# EAGLE design MotorController (EAGLE 9.1.3)
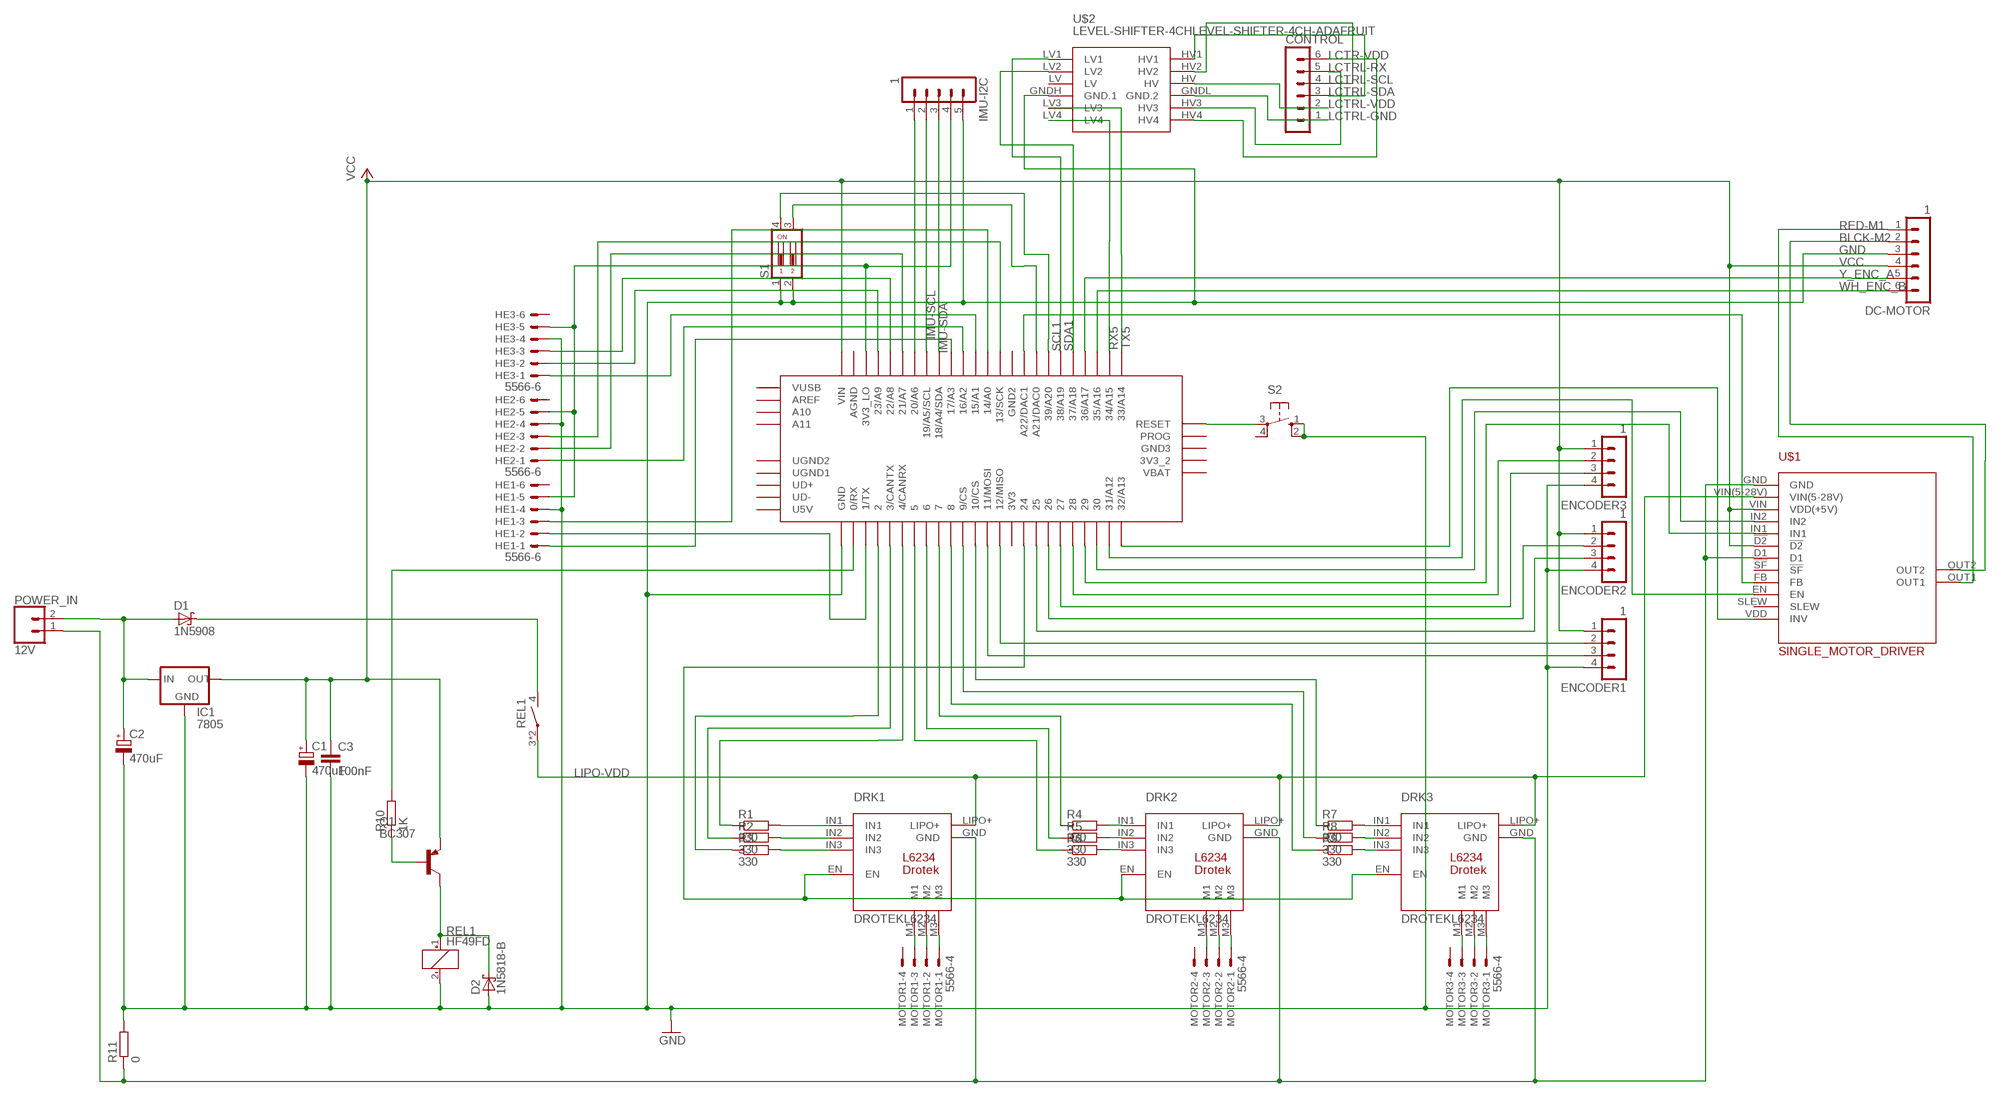
[diagram p0: schematic, sheet 1]

## Parts
C1  470uF  CPOL-EUE7.5-16  [E7,5-16]
C2  470uF  CPOL-EUE7.5-16  [E7,5-16]
C3  100nF  C2.5/2  [C2.5-2]
CONTROL  MA06-1  [MA06-1]
D1  1N5908  [C4111-15]
D2  1N5818-B  [DO41-7.6]
DC-MOTOR  1  MA06-1  [MA06-1]
DRK1  DROTEKL6234  [DROTEKL6234]
DRK2  DROTEKL6234  [DROTEKL6234]
DRK3  DROTEKL6234  [DROTEKL6234]
ENCODER1  1  MA04-1  [MA04-1]
ENCODER2  1  MA04-1  [MA04-1]
ENCODER3  1  MA04-1  [MA04-1]
HE1  5566-6  [5566-6]
HE2  5566-6  [5566-6]
HE3  5566-6  [5566-6]
IC1  7805  78XXL  [78XXL]
IMU-I2C  1  MA05-1  [MA05-1]
MOTOR1  5566-4  [5566-4]
MOTOR2  5566-4  [5566-4]
MOTOR3  5566-4  [5566-4]
POWER_IN  12V  CONN_023.5MM  [SCREWTERMINAL-3.5MM-2]
PRJ1  TEENSY_3.5/3.6  [TEENSY_3.5/3.6]
Q1  BC307  [TO92]
R1  330  R-EU_0204/7  [0204/7]
R2  330  R-EU_0204/7  [0204/7]
R3  330  R-EU_0204/7  [0204/7]
R4  330  R-EU_0204/7  [0204/7]
R5  330  R-EU_0204/7  [0204/7]
R6  330  R-EU_0204/7  [0204/7]
R7  330  R-EU_0204/7  [0204/7]
R8  330  R-EU_0204/7  [0204/7]
R9  330  R-EU_0204/7  [0204/7]
R10  1K  R-EU_0204/7  [0204/7]
R11  0  R-EU_0204/2V  [0204V]
REL1  HF49FD  [HF49FD]
S1  DA02  [DA-02]
S2  10-XX  [B3F-10XX]
U$1  SINGLE_MOTOR_DRIVER  [MOTOR_DRIVER_MC33926_FOOTPRINT_]
U$2  LEVEL-SHIFTER-4CHLEVEL-SHIFTER-4CH-ADAFRUIT  [LEVEL-SHIFTER-4CH-ADAFRUIT]

## Nets
BLCK-M2 [Powerline]: DC-MOTOR.2 U$1.OUT2
GND: C1.- C2.- C3.2 D2.A DC-MOTOR.3 ENCODER1.4 ENCODER2.4 ENCODER3.4 HE1.4 HE2.4 HE3.4 IC1.GND IMU-I2C.5 PRJ1.GND R11.2 REL1.2(-) S1.1 S1.2 S2.1(S) S2.2(S1) U$2.GNDH(GND.1)
IMU-SCL: IMU-I2C.2 PRJ1.19/A5/SCL
IMU-SDA: IMU-I2C.3 PRJ1.18/A4/SDA
LCTR-VDD: CONTROL.6 U$2.HV4
LCTRL-GND: CONTROL.1 U$2.GNDL(GND.2)
LCTRL-RX: CONTROL.5 U$2.HV3
LCTRL-SCL: CONTROL.4 U$2.HV2
LCTRL-SDA: CONTROL.3 U$2.HV1
LCTRL-VDD: CONTROL.2 U$2.HV
LIPO-GND [Powerline]: DRK1.GND DRK2.GND DRK3.GND POWER_IN.1 R11.1 U$1.D1 U$1.GND
LIPO-VDD [Powerline]: DRK1.LIPO+ DRK2.LIPO+ DRK3.LIPO+ REL1.3(P) REL1.5(P) U$1.VIN(5-28V)
N$1 [Powerline]: DRK1.M1 MOTOR1.3
N$2 [Powerline]: DRK1.M2 MOTOR1.2
N$3 [Powerline]: DRK1.M3 MOTOR1.1
N$4: DRK1.IN1 R1.2
N$5: DRK1.IN2 R2.2
N$6: DRK1.IN3 R3.2
N$7: PRJ1.4/CANRX R1.1
N$8: PRJ1.3/CANTX R2.1
N$9: PRJ1.2 R3.1
N$10: DRK1.EN DRK2.EN DRK3.EN PRJ1.24
N$11: DRK2.IN1 R4.2
N$12: PRJ1.21/DAC0(A21/DAC0) S1.3
N$13 [Powerline]: DRK2.M1 MOTOR2.3
N$14 [Powerline]: DRK2.M2 MOTOR2.2
N$15 [Powerline]: DRK2.M3 MOTOR2.1
N$16 [Powerline]: DRK3.M1 MOTOR3.3
N$17 [Powerline]: DRK3.M2 MOTOR3.2
N$18 [Powerline]: DRK3.M3 MOTOR3.1
N$19: DRK2.IN2 R5.2
N$20: DRK2.IN3 R6.2
N$21: PRJ1.5 R6.1
N$22: PRJ1.6 R5.1
N$23: PRJ1.7 R4.1
N$24: DRK3.IN2 R8.2
N$25: DRK3.IN1 R7.2
N$26: DRK3.IN3 R9.2
N$27: PRJ1.8 R9.1
N$28: PRJ1.9/CS R8.1
N$29: PRJ1.10/CS R7.1
N$30: Q1.2(B) R10.1
N$31: D2.C Q1.3(C) REL1.1(+)
N$32 [Powerline]: C2.+ D1.A IC1.IN POWER_IN.2
N$33: ENCODER1.3 PRJ1.11/MOSI
N$34: ENCODER1.2 PRJ1.12/MISO
N$35: ENCODER2.3 PRJ1.25
N$36: ENCODER2.2 PRJ1.26
N$37: ENCODER3.3 PRJ1.27
N$38: ENCODER3.2 PRJ1.28
N$39 [Powerline]: D1.C REL1.4(S)
N$40: PRJ1.39/A20 S1.4
N$41: PRJ1.32/A13 U$1.VDD(INV)
N$42: PRJ1.0/RX R10.2
N$44: PRJ1.29 U$1.IN1
N$45: PRJ1.31/A12 U$1.EN
N$46: HE1.5 HE2.5 HE3.5 IMU-I2C.4 PRJ1.3V3_LO
N$47: PRJ1.30 U$1.IN2
N$48: IMU-I2C.1 PRJ1.20/A6
N$49: HE3.2 PRJ1.23/A9
N$50: HE3.3 PRJ1.22/A8
N$51: HE2.2 PRJ1.21/A7
N$52: PRJ1.RESET S2.3(P)
N$54: HE1.1 PRJ1.17/A3
N$55: HE2.1 PRJ1.16/A2
N$56: HE3.1 PRJ1.15/A1
N$57: HE1.2 PRJ1.1/TX
N$58: HE1.3 PRJ1.14/A0
N$59: HE2.3 PRJ1.13/SCK
N$60: PRJ1.A22/DAC1 U$1.FB
RED-M1 [Powerline]: DC-MOTOR.1 U$1.OUT1
RX5: PRJ1.34/A15 U$2.LV4
SCL1: PRJ1.38/A19 U$2.LV1
SDA1: PRJ1.37/A18 U$2.LV2
TX5: PRJ1.33/A14 U$2.LV3
VCC: C1.+ C3.1 DC-MOTOR.4 ENCODER1.1 ENCODER2.1 ENCODER3.1 IC1.OUT PRJ1.VIN Q1.1(E) U$1.!D2 U$1.VIN(VDD(+5V))
WH_ENC_B: DC-MOTOR.6 PRJ1.35/A16
Y_ENC_A: DC-MOTOR.5 PRJ1.36/A17
Unconnected: HE1.6 HE2.6 HE3.6 MOTOR1.4 MOTOR2.4 MOTOR3.4 PRJ1.3V3 PRJ1.3V3_2 PRJ1.A10 PRJ1.A11 PRJ1.AGND PRJ1.AREF PRJ1.GND2 PRJ1.GND3 PRJ1.PROG PRJ1.U5V PRJ1.UD+ PRJ1.UD- PRJ1.UGND1 PRJ1.UGND2 PRJ1.VBAT PRJ1.VUSB S2.4(P1) U$1.!SF U$1.SLEW

## Power pins joined to a net without a drawn wire
LV: U$2.LV

## Library data of the parts
C1 C2 = rcl:CPOL-EU: POLARIZED CAPACITOR, European symbol; SPICEPREFIX: C
C3 = capacitor-wima:C: CAPACITOR naming: grid - package width
CONTROL DC-MOTOR = con-lstb:MA06-1: PIN HEADER; OC_FARNELL: unknown; OC_NEWARK: unknown
D1 = diode:1N5908: DIODE schottky
D2 = diode:1N581*: 1.0A SCHOTTKY BARRIER RECTIFIER Source: http://www.diodes.com/datasheets/ds23001.pdf
DRK1-DRK3 = Drotek L6234:DROTEKL6234
ENCODER1-ENCODER3 = con-lstb:MA04-1: PIN HEADER; OC_FARNELL: unknown; OC_NEWARK: unknown
HE1-HE3 = con-molex:5566-6: Mini FIT connector 6 pol Source: http://www.molex.com; MF: MOLEX; MPN: 95566-61002; OC_FARNELL: unknown; OC_NEWARK: 22K8620
IC1 = v-reg:78XXL: VOLTAGE REGULATOR
IMU-I2C = con-lstb:MA05-1: PIN HEADER; OC_FARNELL: unknown; OC_NEWARK: unknown
MOTOR1-MOTOR3 = con-molex:5566-4: Mini FIT connector 4 pol Source: http://www.molex.com; MF: MOLEX; OC_FARNELL: unknown; OC_NEWARK: unknown
POWER_IN = SparkFun-Connectors:CONN_02: Multi connection point. Often used as Generic Header-pin footprint for 0.1 inch spaced/style header connections On any of the 0.1 inch spaced packages, you can populate with these: Break Away Headers - Straight <https://www.sparkfun.com/products/116> (PRT-00116) Break Away Male Headers - Right Angle <https://www.sparkfun.com/products/553> (PRT-00553) Female Headers <https://www.sparkfun.com/products/115> (PRT-00115) Break Away Headers - Machine Pin <https://www.sparkfun.com/products/117> (PRT-00117) Break Away Female Headers - Swiss Machine Pin <https://www.sparkfun.com/products/743> (PRT-00743) For SCREWTERMINALS and SPRING TERMINALS visit here: Screw Terimnals on SparkFun.com <https://www.sparkfun.com/search/results?term=Screw+Terminals> (5mm/3.5mm/2.54mm spacing) This device is also useful as a general connection point to wire up your design to another part of your project. Our various solder wires solder well into these plated through hole pads. Hook-Up Wire - Assortment (Stranded, 22 AWG) <https://www.sparkfun.com/products/11375> (PRT-11375) Hook-Up Wire - Assortment (Solid Core, 22 AWG) <https://www.sparkfun.com/products/11367> (PRT-11367) View the entire wire category on our website here <https://www.sparkfun.com/categories/141> Special notes: Molex polarized connector foot print use with: PRT-08233 with associated crimp pins and housings. 2.54_SCREWTERM for use with PRT-10571. 3.5mm Screw Terminal footprints for PRT-08084 5mm Screw Terminal footprints for use with PRT-08432; PROD_ID: CONN-08399
PRJ1 = Teensy356:TEENSY_3.5/3.6
Q1 = transistor-pnp:BC307: PNP Transistor
R1-R11 = resistor:R-EU_: RESISTOR, European symbol
REL1 = relay:HF49FD
S1 = switch-dil:DA02: DIL/CODE SWITCH; OC_FARNELL: 1255229; OC_NEWARK: unknown
S2 = switch-omron:10-XX: OMRON SWITCH; MPN: B3F-1000; OC_FARNELL: 176432; OC_NEWARK: 36M3542
U$1 = pololu motor driver:SINGLE_MOTOR_DRIVER: Single Motor Driver (MC33926)
U$2 = diy-modules:LEVEL-SHIFTER-4CH: 4-Channel Bi-Directional Logic Level Converter based on BSS128 transistors Click here to find device on ebay.com <http://www.ebay.com/sch/i2c+logic+converter+module>

## Net classes
0 default: width 0.254 mm, drill 0.635 mm, clearance 0.635 mm
1 Powerline: width 1 mm, drill 0.635 mm, clearance 0.635 mm

## Board
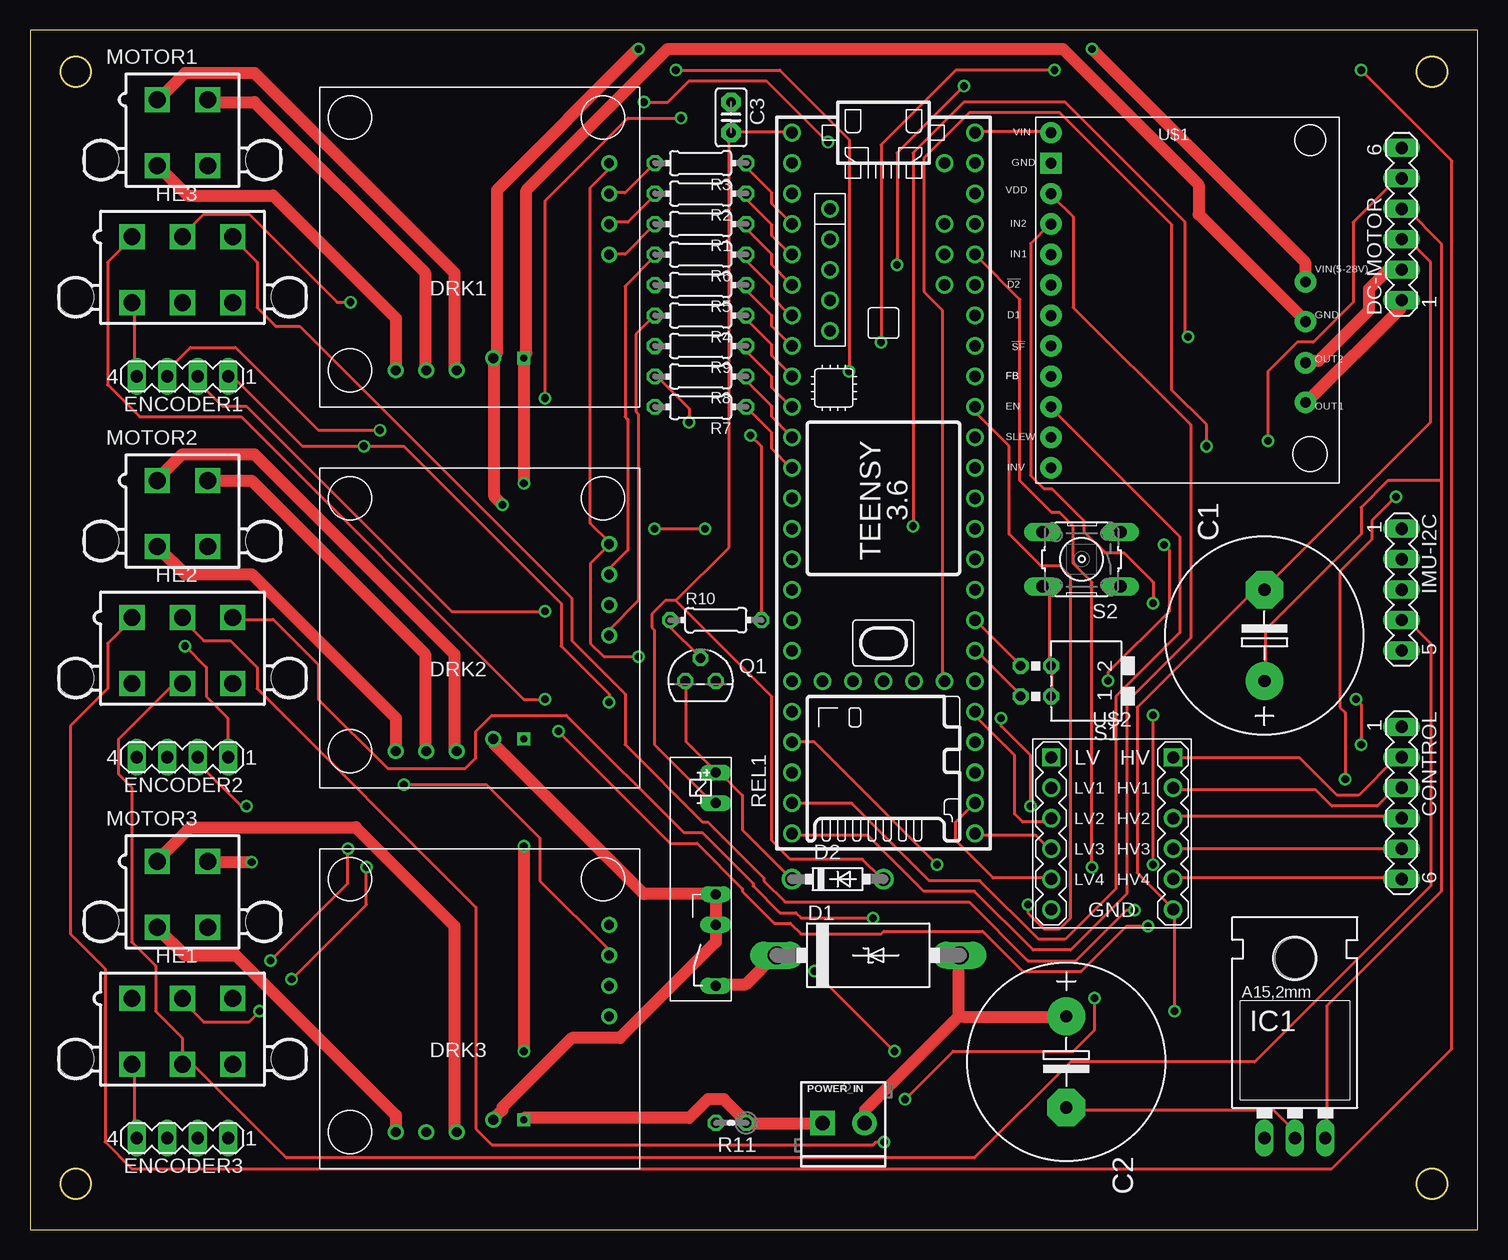
[diagram p1: board, top side]
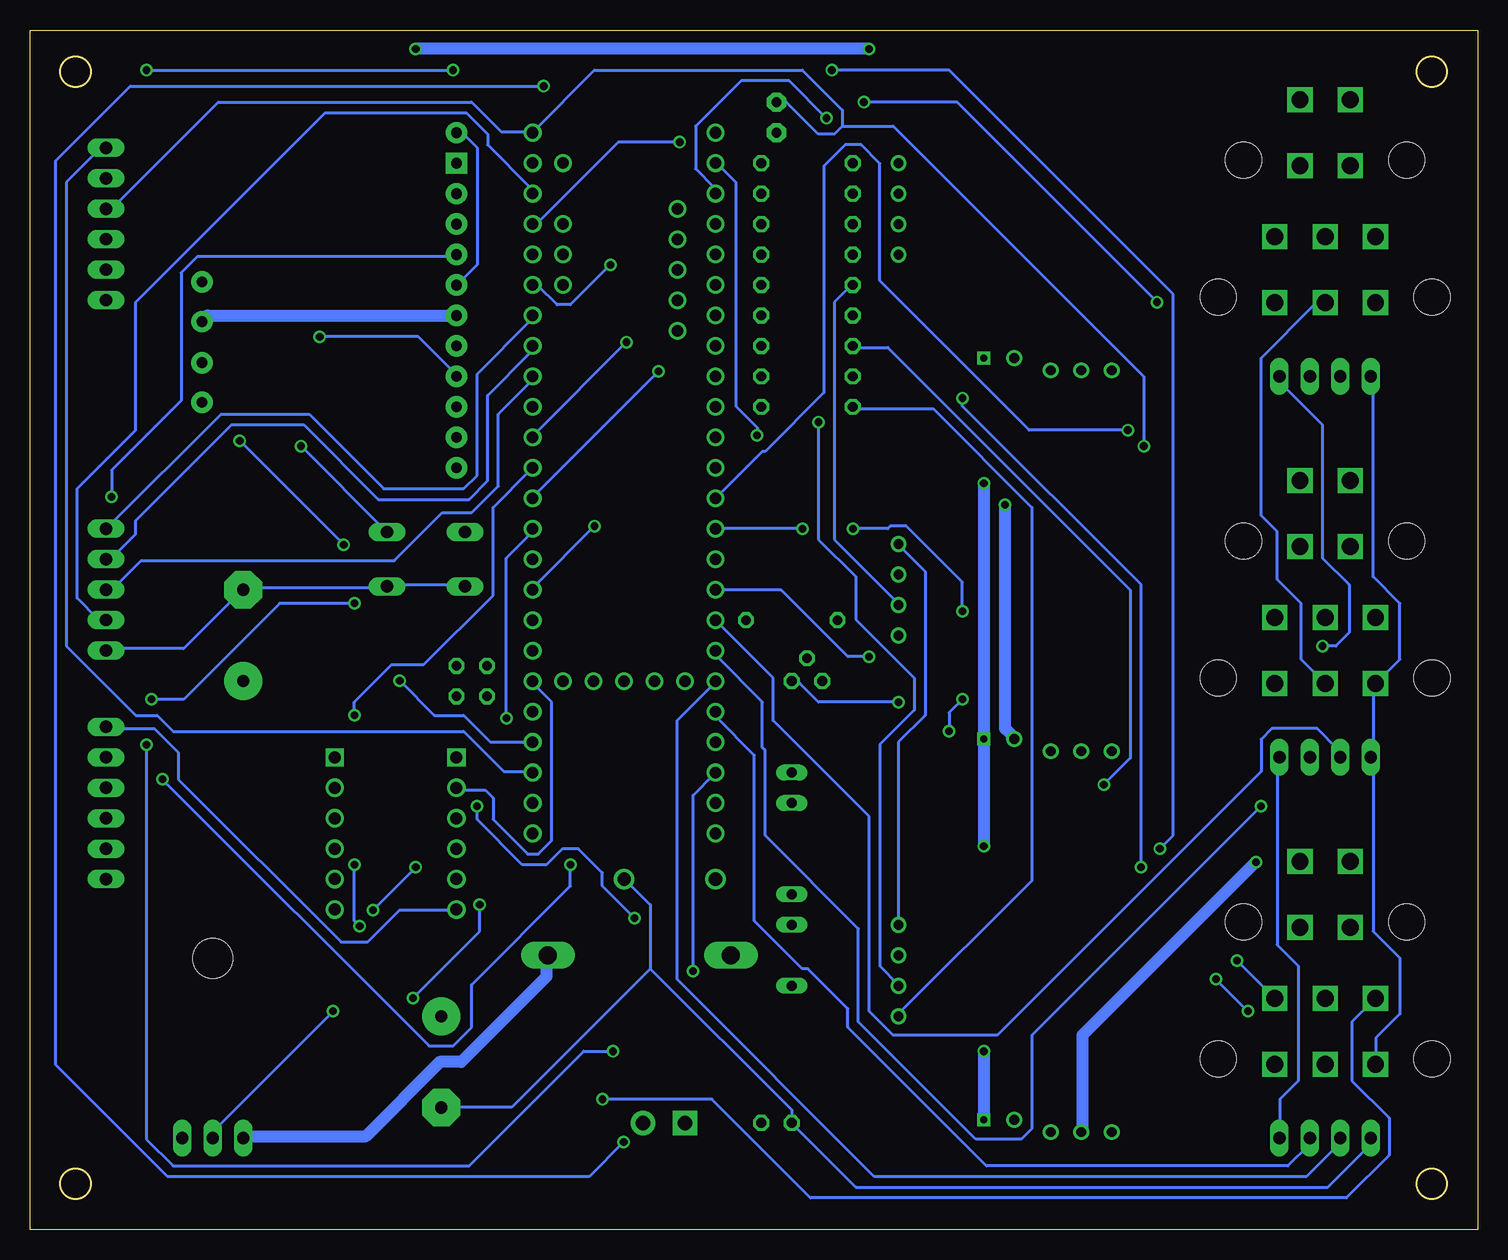
[diagram p2: board, bottom side, seen from below]

Size 120.63 x 100 mm. Coordinates in mm from the lower left corner, seen from the top.
Outline: 0,0 120.63,0 120.63,100 0,100 0,0
Outline: circle at 116.84,96.52 radius 1.27
Outline: circle at 3.81,96.52 radius 1.27
Outline: circle at 3.81,3.81 radius 1.27
Outline: circle at 116.84,3.81 radius 1.27
Copper layers (1*16): Top 0.035mm / dielectric 1.5mm / Bottom 0.035mm
Design rules "default *": minimum track width 6mil, minimum drill 0.35mm, track to track 6mil, track to pad 6mil, pad to pad 6mil, via to via 6mil, smd to smd 6mil, copper to edge 30mil, drill to drill 6mil, minimum pad ring 10mil, minimum via ring 8mil, stop-mask expansion 4mil, vias tented up to drill 0mil, thermal gap 10mil

### Footprints (pad centres in the part's own frame; a part is rotated, then mirrored left to right if it is on the bottom)
E7,5-16 = drill 1.016 pad 3.15: + -3.81,0 | drill 1.016 pad 3.15 octagon: - 3.81,0
C2.5-2 = drill 0.813 pad 1.6 octagon: 1 -1.27,0; 2 1.27,0
MA06-1 = drill 1.016 long: 1 -6.35,0; 2 -3.81,0; 3 -1.27,0; 4 1.27,0; 5 3.81,0; 6 6.35,0
C4111-15 = drill 1.499 long: A 7.62,0; C -7.62,0
DO41-7.6 = drill 1.1 pad 1.7: A 3.81,0; C -3.81,0
DROTEKL6234 = drill 0.813 pad 1.27: EN -11.43,-6.35; IN1 -11.43,1.27; IN2 -11.43,-1.27; IN3 -11.43,-3.81; LIPO+ -1.778,9.906; M1 6.35,10.922; M2 3.81,10.922; M3 1.27,10.922 | drill 0.6 square: GND -4.318,9.906
MA04-1 = drill 1.016 long: 1 -3.81,0; 2 -1.27,0; 3 1.27,0; 4 3.81,0
5566-6 = drill 1.4 square: 1 4.2,-2.75; 2 0,-2.75; 3 -4.2,-2.75; 4 4.2,2.75; 5 0,2.75; 6 -4.2,2.75 | hole 3: 8.9,2.29; -8.9,2.29
78XXL = drill 1.016 long: GND 0,-3.81; IN -2.54,-3.81; OUT 2.54,-3.81 | hole 3.302: 0,11.176
MA05-1 = drill 1.016 long: 1 -5.08,0; 2 -2.54,0; 3 0,0; 4 2.54,0; 5 5.08,0
5566-4 = drill 1.4 square: 1 2.1,-2.75; 2 -2.1,-2.75; 3 2.1,2.75; 4 -2.1,2.75 | hole 3: 6.8,2.29; -6.8,2.29
SCREWTERMINAL-3.5MM-2 = drill 1.2 pad 2.032 square: 1 0,0 | drill 1.2 pad 2.032: 2 3.5,0
TEENSY_3.5/3.6 = drill 0.965: 0/RX -25.4,-7.62; 1/TX -22.86,-7.62; 2 -20.32,-7.62; 3/CANTX -17.78,-7.62; 3V3 7.62,-7.62; 3V3_2 17.78,-2.54; 3V3_LO -22.86,7.62; 4/CANRX -15.24,-7.62; 5 -12.7,-7.62; 6 -10.16,-7.62; 7 -7.62,-7.62; 8 -5.08,-7.62; 9/CS -2.54,-7.62; 10/CS 0,-7.62; 11/MOSI 2.54,-7.62; 12/MISO 5.08,-7.62; 13/SCK 5.08,7.62; 14/A0 2.54,7.62; 15/A1 0,7.62; 16/A2 -2.54,7.62; 17/A3 -5.08,7.62; 18/A4/SDA -7.62,7.62; 19/A5/SCL -10.16,7.62; 20/A6 -12.7,7.62; 21/A7 -15.24,7.62; 21/DAC0 12.7,7.62; 22/A8 -17.78,7.62; 23/A9 -20.32,7.62; 24 10.16,-7.62; 25 12.7,-7.62; 26 15.24,-7.62; 27 17.78,-7.62; 28 20.32,-7.62; 29 22.86,-7.62; 30 25.4,-7.62; 31/A12 27.94,-7.62; 32/A13 30.48,-7.62; 33/A14 30.48,7.62; 34/A15 27.94,7.62; 35/A16 25.4,7.62; 36/A17 22.86,7.62; 37/A18 20.32,7.62; 38/A19 17.78,7.62; 39/A20 15.24,7.62; A10 -17.78,5.08; A11 -15.24,5.08; A22/DAC1 10.16,7.62; AGND -25.4,7.62; AREF -20.32,5.08; GND -27.94,-7.62; GND2 7.62,7.62; GND3 17.78,0; PROG 17.78,2.54; RESET 17.78,5.08; U5V -21.59,-4.445; UD+ -16.51,-4.445; UD- -19.05,-4.445; UGND1 -13.97,-4.445; UGND2 -11.43,-4.445; VBAT 17.78,-5.08; VIN -27.94,7.62; VUSB -25.4,5.08
TO92 = drill 0.813 octagon: 1 1.27,0; 2 0,1.905; 3 -1.27,0
0204/7 = drill 0.813 octagon: 1 -3.81,0; 2 3.81,0
0204V = drill 0.813 octagon: 1 -1.27,0; 2 1.27,0
HF49FD = drill 0.813 long: 1 -7.62,0; 2 -5.08,0; 3 2.54,0; 4 10.16,0; 5 5.08,0
DA-02 = drill 0.813 octagon: 1 -1.27,-1.27; 2 1.27,-1.27; 3 1.27,1.27; 4 -1.27,1.27
B3F-10XX = drill 1.016 long: 1 -3.251,2.261; 2 3.251,2.261; 3 -3.251,-2.261; 4 3.251,-2.261
MOTOR_DRIVER_MC33926_FOOTPRINT_ = drill 0.9 pad 1.778: !D2 -3.81,0; !SF -3.81,-5.08; D1 -3.81,-2.54; EN -3.81,-10.16; FB -3.81,-7.62; GND 17.399,-3.048; IN1 -3.81,2.54; IN2 -3.81,5.08; INV1 -3.81,-15.24; OUT1 17.399,-9.779; OUT2 17.399,-6.477; SLEW -3.81,-12.7; VDD -3.81,7.62; VIN -3.81,12.7; VIN(5-28V) 17.399,0.254 | drill 0.9 pad 1.778 square: GND1 -3.81,10.16
LEVEL-SHIFTER-4CH-ADAFRUIT = drill 1: GNDH 5.08,-6.35; GNDL -5.08,-6.35; HV1 5.08,3.81; HV2 5.08,1.27; HV3 5.08,-1.27; HV4 5.08,-3.81; LV1 -5.08,3.81; LV2 -5.08,1.27; LV3 -5.08,-1.27; LV4 -5.08,-3.81 | drill 1 square: HV 5.08,6.35; LV -5.08,6.35

### Placement (x,y rotation side)
C1  102.87,49.53 90 top
C2  86.36,13.97 270 top
C3  58.42,92.71 270 top
CONTROL  114.3,35.56 270 top
D1  69.85,22.86 0 top
D2  67.31,29.21 0 top
DC-MOTOR  114.3,83.82 90 top
DRK1  36.83,82.55 180 top
DRK2  36.83,50.8 180 top
DRK3  36.83,19.05 180 top
ENCODER1  12.7,71.12 180 top
ENCODER2  12.7,39.37 180 top
ENCODER3  12.7,7.62 180 top
HE1  12.7,16.51 180 top
HE2  12.7,48.26 180 top
HE3  12.7,80.01 180 top
IC1  105.41,11.43 0 top
IMU-I2C  114.3,53.34 270 top
MOTOR1  12.7,91.44 180 top
MOTOR2  12.7,59.69 180 top
MOTOR3  12.7,27.94 180 top
POWER_IN  66.04,8.89 0 top
PRJ1  71.12,63.5 270 top
Q1  55.88,45.72 0 top
R1  55.88,83.82 180 top
R2  55.88,86.36 180 top
R3  55.88,88.9 180 top
R4  55.88,76.2 180 top
R5  55.88,78.74 180 top
R6  55.88,81.28 180 top
R7  55.88,68.58 180 top
R8  55.88,71.12 180 top
R9  55.88,73.66 180 top
R10  57.15,50.8 0 top
R11  58.42,8.89 180 top
REL1  57.15,30.48 270 top
S1  83.82,45.72 90 top
S2  87.63,55.88 180 top
U$1  88.9,78.74 0 top
U$2  90.17,33.02 0 top

### Tracks (layer width: path | path; a pad name or v marks a point on that pad's centre or on a via)
BLCK-M2
  Top 1: DC-MOTOR.2 114.27,79.98 113.16,79.98 111.6,78.42 111.6,76.64 107.38,72.42 106.49,72.42 U$1.OUT2
GND  (via drill 0.64)
  Top 0.254: S1.1 85.15,44.64 85.15,46.86 S1.2 84.93,47.09 84.93,53.09 84.49,53.53 S2.2 | DC-MOTOR.3 114.49,82.42 114.94,82.42 116.71,80.64 116.71,67.31 102.93,53.53 C1.- 102.71,53.31 102.04,53.31 92.27,43.53 92.27,29.75 95.16,26.86 U$2.GNDH 95.38,26.64 v95.38,18.19 | ENCODER1.4 8.7,71.31 8.7,77.09 HE3.4 | ENCODER3.4 8.7,7.75 8.7,13.75 HE1.4 | IC1.GND 105.38,7.75 105.38,8.19 103.6,9.97 86.49,9.97 C2.- | PRJ1.GND 63.37,91.53 58.48,91.53 C3.2 58.26,91.31 58.26,56.86 53.82,52.42 | 53.82,52.42 52.93,52.42 51.82,51.31 51.82,50.2 52.04,49.98 52.04,40.42 56.71,35.75 57.15,35.75 REL1.2 | 53.82,52.42 61.82,44.42 61.82,32.42 63.37,30.86 69.37,30.86 70.93,29.3 D2.A
  Bottom 0.254: S2.2 84.49,53.75 90.71,53.75 S2.1 90.93,53.53 102.71,53.53 C1.- 102.93,53.31 107.82,48.42 114.27,48.42 IMU-I2C.5 | HE1.4 8.48,13.97 8.48,15.97 6.48,17.97 6.48,22.64 8.7,24.86 8.7,39.31 ENCODER2.4 8.7,39.53 8.7,45.31 HE2.4 8.48,45.53 6.48,47.53 6.48,52.2 8.7,54.42 8.7,71.09 ENCODER1.4 | 68.93,21.75 57.15,9.97 57.15,9.08 R11.2 57.15,8.86 51.82,3.52 12.48,3.52 8.92,7.08 8.92,7.53 ENCODER3.4 | 68.93,21.75 68.93,27.08 70.93,29.08 D2.A | 68.93,21.75 80.49,10.19 86.27,10.19 C2.- | v95.38,18.19 105.38,8.19 105.38,7.75 IC1.GND
IMU-SCL
  Bottom 0.254: PRJ1.19/A5/SCL 78.93,73.53 78.93,73.09 82.49,69.53 82.49,62.42 84.04,60.87 91.6,60.87 97.82,67.09 103.82,67.09 111.82,59.09 111.82,57.98 113.82,55.98 114.27,55.98 IMU-I2C.2
IMU-SDA
  Bottom 0.254: PRJ1.18/A4/SDA 78.93,71.09 78.93,70.64 81.6,67.98 81.6,61.98 83.82,59.75 86.27,59.75 90.27,55.75 111.38,55.75 113.6,53.53 114.27,53.53 IMU-I2C.3
LCTR-VDD
  Top 0.254: U$2.HV4 95.38,29.3 114.27,29.3 CONTROL.6
LCTRL-GND
  Bottom 0.254: U$2.GNDL 85.15,26.64 89.82,26.64 92.49,23.97 94.71,23.97 108.27,37.53 108.27,39.75 110.27,41.75 114.27,41.75 CONTROL.1
LCTRL-RX
  Top 0.254: U$2.HV3 95.38,31.75 114.27,31.75 CONTROL.5
LCTRL-SCL
  Top 0.254: U$2.HV2 95.38,34.42 114.27,34.42 CONTROL.4
LCTRL-SDA
  Top 0.254: U$2.HV1 95.38,36.64 107.16,36.64 108.49,35.31 112.27,35.31 113.6,36.64 114.27,36.64 CONTROL.3
LCTRL-VDD
  Top 0.254: U$2.HV 95.38,39.31 105.82,39.31 108.93,36.2 110.71,36.2 113.82,39.31 114.27,39.31 CONTROL.2
LIPO-GND  (via drill 0.64)
  Top 1: DRK3.GND 41.15,9.3 54.93,9.3 56.48,10.86 57.82,10.86 59.6,9.08 R11.1 60.04,8.86 66.04,8.86 POWER_IN.1 | v41.15,62.2 DRK1.GND 41.37,73.09 41.37,86.65 53.15,98.42 86.04,98.42 97.38,87.09 97.38,84.64 106.27,75.75 U$1.GND | v41.15,31.97 v41.15,14.86
  Bottom 1: U$1.D1 85.15,76.2 105.82,76.2 106.27,75.75 U$1.GND | v41.15,62.2 41.15,41.08 DRK2.GND 41.15,40.42 v41.15,31.97 | v41.15,14.86 41.15,9.3 DRK3.GND
LIPO-VDD  (via drill 0.64)
  Top 1: DRK3.LIPO+ 38.7,9.3 39.37,9.97 39.37,10.19 45.15,15.97 49.15,15.97 57.15,23.97 57.15,25.3 REL1.5 57.15,25.75 57.15,27.53 REL1.3 57.15,27.97 51.15,27.97 38.7,40.42 38.7,40.86 DRK2.LIPO+ | v39.37,60.42 38.7,61.09 38.7,72.64 DRK1.LIPO+ 38.93,73.09 38.93,86.65 v50.71,98.42 | v88.49,98.42 106.27,80.64 106.27,79.09 U$1.VIN(5-28V)
  Bottom 1: v39.37,60.42 39.37,41.75 38.7,41.08 DRK2.LIPO+ | v50.71,98.42 v88.49,98.42
N$1
  Top 1: DRK1.M1 30.48,71.75 30.48,75.98 20.26,86.2 13.15,86.2 10.7,88.65 MOTOR1.3
N$2
  Top 1: DRK1.M2 32.93,71.75 32.93,79.76 18.7,93.98 14.92,93.98 MOTOR1.2
N$3
  Top 1: DRK1.M3 35.37,71.75 35.37,79.76 18.7,96.42 12.92,96.42 10.7,94.2 MOTOR1.1
N$4
  Top 0.254: DRK1.IN1 48.26,81.31 49.59,81.31 52.04,83.76 R1.2
N$5
  Top 0.254: DRK1.IN2 48.26,83.98 49.82,83.98 52.04,86.2 R2.2
N$6
  Top 0.254: DRK1.IN3 48.26,86.42 49.59,86.42 52.04,88.87 R3.2
N$7
  Top 0.254: R1.1 59.82,83.76 59.82,83.31 61.82,81.31 61.82,80.42 63.37,78.87 PRJ1.4/CANRX
N$8
  Top 0.254: R2.1 59.82,86.2 59.82,85.76 61.82,83.76 61.82,82.87 63.37,81.31 PRJ1.3/CANTX
N$9
  Top 0.254: R3.1 59.82,88.87 59.82,88.42 61.82,86.42 61.82,85.53 63.37,83.98 PRJ1.2
N$10  (via drill 0.64)
  Top 0.254: DRK1.EN 48.26,88.87 48.26,88.42 46.7,86.87 46.7,58.87 48.26,57.31 DRK2.EN 48.26,57.09 46.7,55.53 46.7,48.86 47.82,47.75 v50.71,47.75
  Bottom 0.254: DRK3.EN 48.26,25.53 48.26,40.64 46.04,42.86 46.04,54.86 48.26,57.09 DRK2.EN | v50.71,47.75 52.48,47.75 58.04,53.31 63.37,53.31 PRJ1.24
N$11
  Top 0.254: DRK2.IN1 48.26,49.98 50.71,52.42 50.71,67.98 50.48,68.2 50.48,74.64 52.04,76.2 R4.2
N$12
  Top 0.254: S1.3 82.49,47.09 78.93,50.64 PRJ1.21/DAC0
N$13
  Top 1: DRK2.M1 30.48,39.97 30.48,42.64 18.48,54.64 12.92,54.64 10.7,56.86 MOTOR2.3
N$14
  Top 1: DRK2.M2 32.93,39.97 32.93,47.97 18.48,62.42 14.92,62.42 MOTOR2.2
N$15
  Top 1: DRK2.M3 35.37,39.97 35.37,47.97 18.7,64.64 12.7,64.64 10.7,62.64 MOTOR2.1
N$16
  Top 1: DRK3.M1 30.48,8.19 30.48,9.53 17.15,22.86 12.92,22.86 10.7,25.08 MOTOR3.3
N$17  (via drill 0.64)
  Top 1: v18.48,30.64 14.92,30.64 MOTOR3.2
  Bottom 1: v18.48,30.64 32.93,16.19 32.93,8.19 DRK3.M2
N$18
  Top 1: DRK3.M3 35.37,8.19 35.37,25.3 27.15,33.53 13.37,33.53 10.7,30.86 MOTOR3.1
N$19
  Bottom 0.254: DRK2.IN2 48.26,52.2 53.59,57.53 53.59,77.31 52.26,78.64 R5.2
N$20
  Top 0.254: DRK2.IN3 48.26,54.64 48.26,55.09 49.82,56.64 49.82,67.53 49.59,67.75 49.59,78.64 52.04,81.09 R6.2
N$21
  Top 0.254: R6.1 59.82,81.09 59.82,80.64 61.82,78.64 61.82,77.76 63.37,76.2 PRJ1.5
N$22
  Top 0.254: R5.1 59.82,78.64 59.82,78.2 61.82,76.2 61.82,75.31 63.37,73.75 PRJ1.6
N$23
  Top 0.254: R4.1 59.82,76.2 59.82,75.75 61.82,73.75 61.82,72.87 63.37,71.31 PRJ1.7
N$24  (via drill 0.64)
  Top 0.254: v54.93,67.31 54.93,68.42 52.26,71.09 R8.2
  Bottom 0.254: v54.93,67.31 54.93,57.53 51.82,54.42 51.82,50.86 46.93,45.97 46.93,43.31 49.82,40.42 49.82,21.97 48.26,20.41 DRK3.IN2
N$25
  Bottom 0.254: DRK3.IN1 48.26,17.97 37.15,29.08 37.15,60.2 45.37,68.42 52.04,68.42 R7.2
N$26  (via drill 0.64)
  Top 0.254: DRK3.IN3 48.26,23.3 42.48,29.08 42.48,32.64 38.04,37.08 v31.15,37.08
  Bottom 0.254: v31.15,37.08 28.92,39.31 28.92,53.31 49.15,73.53 52.04,73.53 R9.2
N$27
  Top 0.254: R9.1 59.82,73.53 59.82,73.09 61.82,71.09 61.82,70.2 63.37,68.64 PRJ1.8
N$28
  Top 0.254: R8.1 59.82,71.09 59.82,70.64 61.82,68.64 61.82,67.75 63.37,66.2 PRJ1.9/CS
N$29
  Top 0.254: R7.1 59.82,68.42 61.82,66.42 61.82,65.09 63.37,63.53 PRJ1.10/CS
N$30
  Top 0.254: R10.1 53.37,50.64 53.37,50.2 55.82,47.75 Q1.2
N$31
  Top 0.254: Q1.3 54.71,45.53 54.71,40.64 57.15,38.2 REL1.1 57.15,37.97 57.6,37.97 59.37,36.2 59.37,33.31 63.37,29.3 D2.C
N$32
  Top 1: 77.38,17.75 69.6,9.97 69.6,9.08 POWER_IN.2 | 77.38,17.75 77.38,22.86 D1.A | C2.+ 86.27,17.75 77.82,17.75 77.38,17.75
  Bottom 1: IC1.IN 102.71,7.75 92.71,7.75 86.49,13.97 84.71,13.97 77.6,21.08 77.6,22.86 D1.A
N$33  (via drill 0.64)
  Top 0.254: v29.15,66.64 24.04,66.64 17.15,73.53 13.37,73.53 11.59,71.75 11.59,71.31 ENCODER1.3
  Bottom 0.254: v29.15,66.64 37.37,66.64 49.82,79.09 49.82,88.87 51.37,90.42 52.71,90.42 54.48,88.65 54.48,69.75 59.37,64.87 59.6,64.87 63.37,61.09 PRJ1.11/MOSI
N$34  (via drill 0.64)
  Top 0.254: v52.04,58.42 v56.26,58.42 | v42.93,51.53 35.15,51.53 18.03,68.64 16.03,68.64 14.03,70.64 14.03,71.09 ENCODER1.2
  Bottom 0.254: v56.26,58.42 63.37,58.42 PRJ1.12/MISO | v52.04,58.42 49.15,58.42 48.93,58.64 47.59,58.64 42.93,53.98 v42.93,51.53
N$35
  Bottom 0.254: PRJ1.25 63.37,50.64 58.71,45.97 58.71,42.42 50.71,34.42 50.71,18.19 48.7,16.19 40.04,16.19 18.03,38.2 18.03,40.86 17.15,41.75 13.37,41.75 11.59,39.97 11.59,39.53 ENCODER2.3
N$36  (via drill 0.64)
  Top 0.254: v18.03,35.31 17.59,35.31 14.03,38.86 14.03,39.31 ENCODER2.2
  Bottom 0.254: v18.03,35.31 37.15,16.19 37.15,8.41 38.04,7.53 41.82,7.53 51.59,17.3 51.59,25.08 59.37,32.86 59.37,39.97 59.6,40.2 59.6,43.97 63.37,47.75 63.37,48.2 PRJ1.26
N$37
  Bottom 0.254: PRJ1.27 63.6,45.53 66.71,42.42 66.71,20.86 50.26,4.41 14.26,4.41 11.59,7.08 11.59,7.53 ENCODER3.3
N$38
  Bottom 0.254: PRJ1.28 63.37,43.09 63.37,42.64 60.26,39.53 60.26,25.75 56.26,21.75 55.82,21.75 52.48,18.41 52.48,16.86 40.93,5.3 15.81,5.3 14.03,7.08 14.03,7.53 ENCODER3.2
N$39
  Top 1: REL1.4 57.15,20.41 59.6,20.41 62.04,22.86 D1.C
N$40
  Top 0.254: S1.4 82.49,44.64 78.93,48.2 PRJ1.39/A20
N$41
  Top 0.254: PRJ1.32/A13 63.6,32.86 69.82,32.86 74.49,28.19 78.71,28.19 83.6,23.3 86.71,23.3 91.38,27.97 91.38,43.97 96.71,49.31 96.71,67.09 86.93,76.87 86.93,84.42 85.15,86.2 U$1.VDD
N$42  (via drill 0.64)
  Top 0.254: v60.04,66.2 60.93,65.31 60.93,50.86 R10.2
  Bottom 0.254: v60.04,66.2 60.04,66.87 61.82,68.64 61.82,87.31 63.37,88.87 PRJ1.0/RX
N$44  (via drill 0.64)
  Top 0.254: v75.6,30.42 65.37,40.64 63.6,40.64 PRJ1.29 | v109.6,37.53 109.6,43.09 109.16,43.53 109.16,54.86 111.82,57.53 111.82,59.09 v113.82,61.09
  Bottom 0.254: v75.6,30.42 75.6,28.64 83.82,20.41 83.82,16.86 85.38,15.3 87.38,15.3 v109.6,37.53 | v113.82,61.09 113.82,63.31 108.05,69.09 108.05,79.76 106.71,81.09 85.15,81.09 U$1.IN1
N$45
  Top 0.254: PRJ1.31/A12 63.6,35.53 68.49,35.53 74.93,29.08 79.15,29.08 84.04,24.19 86.27,24.19 90.49,28.42 90.49,44.42 95.82,49.75 95.82,57.75 85.15,68.42 U$1.EN
N$46
  Top 0.254: HE2.5 12.7,45.31 11.81,45.31 7.37,40.86 7.37,37.97 8.48,36.86 8.48,23.97 10.48,21.97 10.48,18.19 12.7,15.97 12.7,13.97 HE1.5 12.7,13.75 13.59,13.75 21.37,5.97 78.71,5.97 86.71,13.97 102.04,13.97 116.71,28.64 116.71,48.86 114.94,50.64 114.49,50.64 IMU-I2C.4
  Bottom 0.254: HE3.5 12.7,77.09 13.59,77.09 18.03,72.64 18.03,59.53 16.7,58.2 16.7,54.2 14.7,52.2 14.7,47.53 12.7,45.53 HE2.5 | PRJ1.3V3_LO 78.93,86.42 78.93,86.87 82.49,90.42 82.49,91.31 84.27,93.09 96.04,93.09 111.82,77.31 111.82,66.64 116.71,61.75 116.71,52.64 114.94,50.86 114.49,50.86 IMU-I2C.4
N$47  (via drill 0.64)
  Top 0.254: v72.04,14.86 v65.37,21.53 | v110.94,40.42 110.94,43.75 v110.49,44.2 | v93.6,52.2 93.6,53.98 91.15,56.42 89.6,56.42 87.82,58.2 87.82,59.09 85.15,61.75 84.49,61.75 83.38,62.87 83.38,82.2 84.93,83.76 U$1.IN2
  Bottom 0.254: v65.37,21.53 65.37,36.2 63.6,37.97 PRJ1.30 | v72.04,14.86 74.49,14.86 84.04,5.3 108.71,5.3 110.94,7.53 v110.94,40.42 | v110.49,44.2 107.82,44.2 99.82,52.2 v93.6,52.2
N$48
  Bottom 0.254: PRJ1.20/A6 78.93,76.2 78.93,75.75 83.38,71.31 83.38,62.87 84.49,61.75 91.15,61.75 97.38,67.98 104.71,67.98 114.27,58.42 IMU-I2C.1
N$49  (via drill 0.64)
  Top 0.254: v66.49,90.65 61.37,95.76 54.93,95.76 53.15,93.98 v51.15,93.98 | v26.7,77.31 25.59,77.31 18.26,84.64 14.48,84.64 12.7,82.87 HE3.2
  Bottom 0.254: v66.49,90.65 71.6,90.65 78.26,83.98 78.71,83.98 PRJ1.23/A9 | v51.15,93.98 43.37,93.98 v26.7,77.31
N$50  (via drill 0.64)
  Top 0.254: v88.49,30.19 88.49,53.98 86.93,55.53 86.93,58.64 85.82,59.75 85.15,59.75 82.49,62.42 82.49,77.53 78.93,81.09 PRJ1.22/A8 | v92.04,26.64 91.38,26.64 87.15,22.41 83.15,22.41 78.26,27.3 62.93,27.3 61.15,29.08 61.15,29.3 56.48,33.97 56.04,33.97 49.59,40.42 49.59,44.64 45.15,49.09 45.15,52.64 22.48,75.31 20.48,75.31 18.92,76.87 18.92,80.64 16.92,82.64 HE3.3
  Bottom 0.254: v92.04,26.64 v88.49,30.19
N$51  (via drill 0.64)
  Top 0.254: v72.26,80.42 72.26,89.76 v77.82,95.31 | v71.15,7.3 70.49,7.3 70.26,7.08 38.48,7.08 37.15,8.41 37.15,26.86 18.92,45.09 18.92,46.86 16.7,49.09 14.48,49.09 12.7,50.86 HE2.2
  Bottom 0.254: v72.26,80.42 75.6,77.09 76.71,77.09 78.26,78.64 78.71,78.64 PRJ1.21/A7 | v77.82,95.31 112.27,95.31 118.49,89.09 118.49,13.75 109.16,4.41 74.04,4.41 v71.15,7.3
N$52  (via drill 0.64)
  Top 0.254: v98.04,65.31 98.04,67.09 95.16,69.98 95.16,83.76 85.82,93.09 78.26,93.09 74.49,89.31 74.49,78.2 76.04,76.64 76.04,45.75 PRJ1.RESET
  Bottom 0.254: v98.04,65.31 90.93,58.2 S2.3
N$54  (via drill 0.64)
  Top 0.254: v83.15,27.08 83.15,26.42 84.49,25.08 85.82,25.08 86.71,25.97 86.71,54.42 85.82,55.31 84.27,55.31 81.6,57.98 81.6,65.31 78.93,67.98 78.93,68.42 PRJ1.17/A3 | v88.71,19.3 88.71,16.64 86.93,14.86 76.93,14.86 v72.93,10.86
  Bottom 0.254: v83.15,27.08 83.15,24.86 v88.71,19.3 | v72.93,10.86 63.82,10.86 55.59,2.63 10.92,2.63 7.37,6.19 7.37,9.3 10.48,12.41 10.48,17.3 8.7,19.08 HE1.1
N$55  (via drill 0.64)
  Top 0.254: v70.93,73.98 70.93,90.42 77.15,96.65 v85.38,96.65 | v110.94,96.65 118.49,89.09 118.49,15.08 108.49,5.08 8.48,5.08 6.26,7.3 6.26,21.75 3.37,24.64 3.37,41.97 6.48,45.09 6.48,48.86 8.48,50.86 HE2.1
  Bottom 0.254: v70.93,73.98 78.71,66.2 PRJ1.16/A2 | v110.94,96.65 v85.38,96.65
N$56  (via drill 0.64)
  Top 0.254: v93.6,30.42 v93.6,42.86 | v93.15,25.3 91.38,25.3 87.6,21.53 82.71,21.53 79.38,24.86 71.15,24.86 70.93,24.64 64.26,24.64 63.37,25.53 62.04,25.53 59.37,28.19 59.37,28.42 55.59,32.19 53.37,32.19 v44.04,41.53 | v42.93,44.2 41.15,44.2 17.59,67.75 9.14,67.75 6.48,70.42 6.48,80.64 8.48,82.64 HE3.1
  Bottom 0.254: v93.6,42.86 93.6,43.97 90.49,47.09 87.82,47.09 82.04,52.86 82.04,60.2 78.93,63.31 PRJ1.15/A1 | v93.6,30.42 93.6,25.75 v93.15,25.3 | v44.04,41.53 44.04,43.09 v42.93,44.2
N$57  (via drill 0.64)
  Top 0.254: v54.26,92.65 49.82,92.65 42.93,85.76 v42.93,69.31 | v28.04,30.19 28.04,27.08 v21.81,20.86 | v19.15,18.19 18.26,17.3 14.48,17.3 12.7,19.08 HE1.2
  Bottom 0.254: v54.26,92.65 57.37,95.76 61.37,95.76 65.15,91.98 65.15,88.42 63.6,86.87 63.6,86.42 PRJ1.1/TX | v42.93,69.31 42.93,68.64 28.04,53.75 v28.04,30.19 | v19.15,18.19 v21.81,20.86
N$58  (via drill 0.64)
  Top 0.254: v68.26,71.53 68.26,90.87 62.48,96.65 v53.82,96.65 | v26.48,31.75 26.48,28.86 v20.03,22.41
  Bottom 0.254: v68.26,71.53 78.71,61.09 PRJ1.14/A0 | v53.82,96.65 44.04,96.65 25.37,77.98 25.37,32.86 v26.48,31.75 | v20.03,22.41 16.92,19.3 HE1.3
N$59  (via drill 0.64)
  Top 0.254: v80.93,42.64 80.93,41.97 83.38,39.53 v83.38,35.31 | v70.26,25.97 64.26,25.97 63.82,26.42 62.48,26.42 60.26,28.64 60.26,28.86 56.04,33.08 54.48,33.08 44.7,42.86 38.48,42.86 37.15,41.53 37.15,39.31 36.26,38.42 29.81,38.42 24.04,44.2 24.04,47.09 20.26,50.86 16.92,50.86 HE2.3
  Bottom 0.254: v80.93,42.64 80.93,55.98 78.93,57.98 78.93,58.42 PRJ1.13/SCK | v83.38,35.31 83.38,34.2 79.6,30.42 77.6,30.42 76.26,31.75 74.93,31.75 72.93,29.75 72.93,28.64 v70.26,25.97
N$60  (via drill 0.64)
  Top 0.254: v73.6,58.64 73.6,89.76 77.82,93.98 86.27,93.98 96.27,83.98 96.27,74.64 v96.49,74.42
  Bottom 0.254: v73.6,58.64 78.71,53.53 PRJ1.A22/DAC1 | v96.49,74.42 88.27,74.42 85.15,71.31 U$1.FB
RED-M1
  Top 1: DC-MOTOR.1 114.27,77.31 114.27,76.87 106.49,69.09 U$1.OUT1
RX5
  Top 0.254: PRJ1.34/A15 78.71,35.53 77.15,33.97 77.15,32.42 80.26,29.3 84.93,29.3 U$2.LV4
SCL1
  Bottom 0.254: PRJ1.38/A19 78.71,45.53 77.15,43.97 77.15,32.42 78.26,31.3 79.15,31.3 82.04,34.2 82.04,35.97 82.71,36.64 84.93,36.64 U$2.LV1
SDA1
  Top 0.254: PRJ1.37/A18 78.93,43.09 78.93,42.64 82.04,39.53 82.04,34.64 82.71,33.97 84.71,33.97 84.93,34.2 U$2.LV2
TX5
  Top 0.254: PRJ1.33/A14 78.93,32.86 83.82,32.86 84.93,31.75 U$2.LV3
VCC  (via drill 0.64)
  Top 0.254: v48.26,43.97 48.26,44.64 44.26,48.64 44.26,52.2 31.15,65.31 v27.81,65.31 22.7,65.31 16.7,71.31 ENCODER1.1 | v12.92,48.64 14.7,46.86 14.7,44.42 16.48,42.64 16.48,39.53 ENCODER2.1 | PRJ1.VIN 78.93,91.53 84.93,91.53 U$1.VIN | 117.6,62.42 117.6,82.2 114.71,85.09 114.49,85.09 DC-MOTOR.4 | 117.6,62.42 117.6,28.19 108.05,18.64 108.05,7.75 IC1.OUT | 117.6,62.42 113.16,62.42 110.94,60.2 110.94,57.98 102.93,49.98 102.93,45.75 C1.+
  Bottom 0.254: ENCODER3.1 16.48,7.75 16.48,10.86 14.92,12.41 14.92,21.97 16.7,23.75 16.7,39.31 ENCODER2.1 | v48.26,43.97 54.93,43.97 56.48,45.53 57.15,45.53 Q1.1 | v12.92,48.64 11.81,48.64 10.7,49.75 10.7,53.75 12.92,55.98 12.92,67.09 16.48,70.64 16.48,71.09 ENCODER1.1 | 52.93,91.98 53.59,91.31 54.93,91.31 57.6,93.98 58.26,93.98 C3.1 | 52.93,91.98 52.93,93.31 56.26,96.65 73.6,96.65 78.71,91.53 PRJ1.VIN 78.93,91.53 81.38,91.53 83.82,93.98 104.93,93.98 113.82,85.09 114.27,85.09 DC-MOTOR.4 | U$1.!D2 84.93,78.87 83.38,80.42 83.38,90.2 84.49,91.31 84.93,91.31 U$1.VIN | v27.81,65.31 27.81,71.09 48.7,91.98 52.93,91.98
WH_ENC_B
  Bottom 0.254: PRJ1.35/A16 78.93,38.2 81.15,38.2 84.49,41.53 108.71,41.53 110.05,42.86 111.82,42.86 117.6,48.64 117.6,87.31 114.94,89.98 114.49,89.98 DC-MOTOR.6
Y_ENC_A  (via drill 0.64)
  Top 0.254: v89.82,45.75 89.82,46.42 94.93,51.53 94.93,56.64 v94.49,57.09 | v103.16,65.75 103.16,71.53 105.6,73.98 106.93,73.98 110.27,77.31 110.27,83.98 113.82,87.53 114.27,87.53 DC-MOTOR.5
  Bottom 0.254: v89.82,45.75 86.93,42.86 84.49,42.86 82.26,40.64 78.93,40.64 PRJ1.36/A17 | v103.16,65.75 v94.49,57.09